# EAGLE design PJ20 (EAGLE 7.4.0)
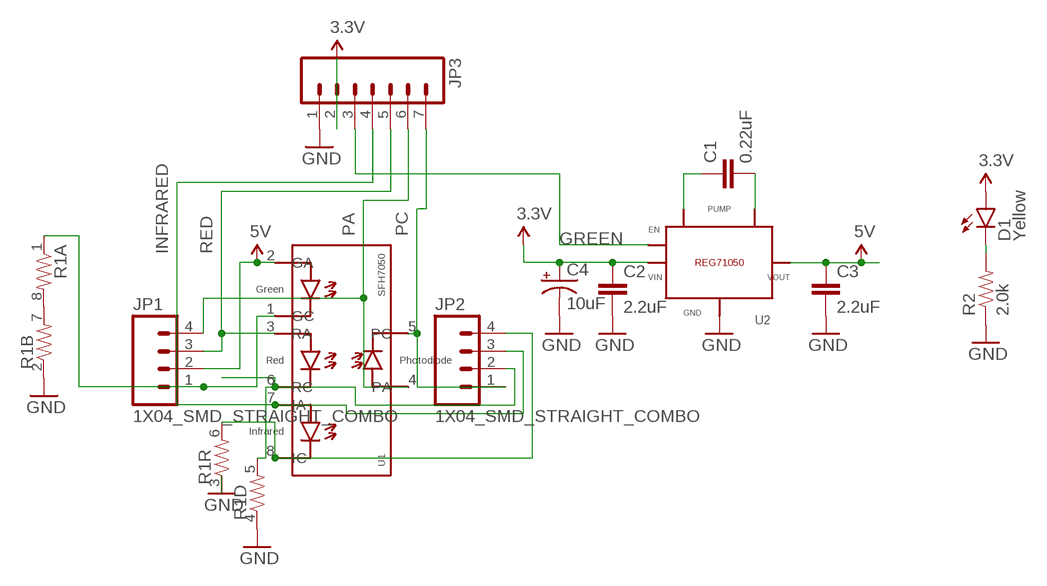
[diagram p0: schematic, sheet 1]

## Parts
C1  0.22uF  0.22UF-25V-10%(0603)  [0603-CAP]
C2  2.2uF  2.2UF-25V-+80/-20(0805)  [0805-CAP]
C3  2.2uF  2.2UF-25V-+80/-20(0805)  [0805-CAP]
C4  10uF  10UF-16V-10%(TANT)  [EIA3216]
D1  Yellow  LED-YELLOW0603  [LED-0603]
JP1  1X04_SMD_STRAIGHT_COMBO  M04SMD_STRAIGHT_COMBO  [1X04_SMD_STRAIGHT_COMBO]
JP2  1X04_SMD_STRAIGHT_COMBO  M04SMD_STRAIGHT_COMBO  [1X04_SMD_STRAIGHT_COMBO]
JP3  M07LOCK  [1X07_LOCK]
R1  RESISTOR-ARRAY0603-ARV  [0603-ARV]
R2  2.0k  2.0KOHM1/10W5%(0603)  [0603-RES]
U1  SFH7050  [SFH7050]
U2  REG71050  [DDC]

## Nets
3.3V: C2.1 C4.A(+) D1.A JP3.2 U2.5(VIN)
5V: C3.1 JP1.2 U1.2(GA) U2.1(VOUT)
GND: C2.2 C3.2 C4.C(-) JP3.1 R1.2 R1.3 R1.4 R2.1 U2.2(GND)
GREEN: JP3.3 U2.3(ENABLE)
INFRARED: JP2.3 JP3.4 U1.7(IA)
N$1: JP1.1 R1.1 U1.1(GC)
N$2: D1.C R2.2
N$3: C1.1 U2.4(CPUMP-)
N$4: C1.2 U2.6(CPUMP+)
N$8: JP2.2 R1.5 U1.6(RC)
N$10: JP2.4 R1.6 U1.8(IC)
N$11: R1.7 R1.8
PA: JP1.4 JP3.6 U1.4(PA)
PC: JP2.1 JP3.7 U1.5(PC)
RED: JP1.3 JP3.5 U1.3(RA)

## Library data of the parts
C1 = SparkFun-Capacitors:0.22UF-25V-10%(0603): CAP-07822; PROD_ID: CAP-07822
C2 C3 = SparkFun-Capacitors:2.2UF-25V-+80/-20(0805): CAP-11624; PROD_ID: CAP-11624
C4 = SparkFun-Capacitors:10UF-16V-10%(TANT): CAP-00811 1206/EIA-3216 Tantalum capacitor; PROD_ID: CAP-00811
D1 = SparkFun-LED:LED-YELLOW: Yellow SMD LEDs LilyPad 1206- DIO-09909 0603- DIO-09003 "SMART" means more efficient and expensive; PROD_ID: DIO-09003
JP1 JP2 = SparkFun-Connectors:M04: Header 4 Standard 4-pin 0.1" header. Use with straight break away headers (SKU : PRT-00116), right angle break away headers (PRT-00553), swiss pins (PRT-00743), machine pins (PRT-00117), and female headers (PRT-00115). Molex polarized connector foot print use with SKU : PRT-08231 with associated crimp pins and housings. 1MM SMD Version SKU: PRT-10208; PROD_ID: CONN-08511
JP3 = SparkFun-Connectors:M07: Header 7 Standard 7-pin 0.1" header. Use with straight break away headers (SKU : PRT-00116), right angle break away headers (PRT-00553), swiss pins (PRT-00743), machine pins (PRT-00117), and female headers (PRT-00115). NOTES ON THE VARIANTS LOCK and LOCK_LONGPADS... This footprint was designed to help hold the alignment of a through-hole component (i.e. 7-pin header) while soldering it into place. You may notice that each hole has been shifted either up or down by 0.005 of an inch from it's more standard position (which is usually a perfectly straight line). This slight alteration caused the pins (the squares in the middle) to touch the edges of the holes. Because they are alternating, it causes a "brace" to hold the header in place. 0.005 has proven to be the perfect amount of "off-center" position when using our standard breakaway headers. Although looks a little odd when you look at the bare footprint, once you have a header in there, the alteration is very hard to notice. Also, if you push a header all the way into place, it is covered up entirely on the bottom side. This idea of altering the position of holes to aid alignment will be further integrated into the Sparkfun Library for other footprints. It can help hold any component with 3 or more connection pins.
R1 = SparkFun-Resistors:RESISTOR-ARRAY: Array Chip Resistor Source: RS Component / Phycomp
R2 = SparkFun-Resistors:2.0KOHM1/10W5%(0603): RES-08296; PROD_ID: RES-08296
U1 = PJ20:SFH7050
U2 = PJ20:REG71050

## Board
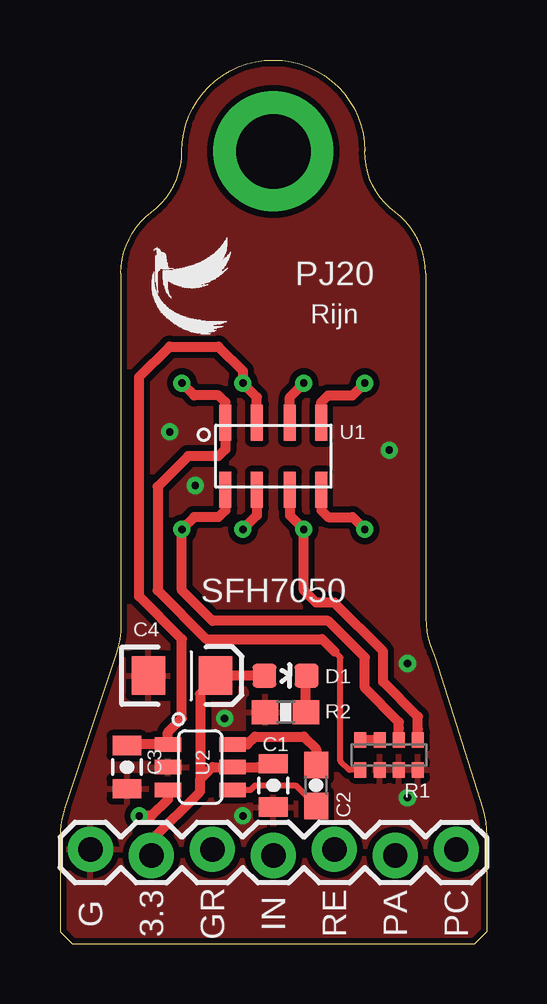
[diagram p1: board, top side]
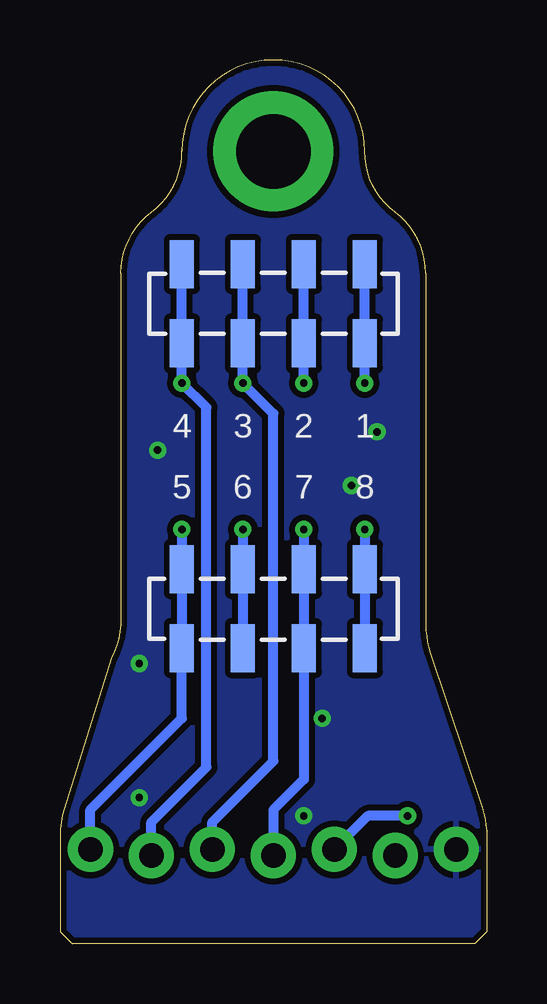
[diagram p2: board, bottom side, seen from below]

Size 17.78 x 36.83 mm. Coordinates in mm from the lower left corner, seen from the top.
Outline: 0.51,0 17.27,0 17.78,0.51 17.78,4.5 arc17 17.61,5.64 15.64,11.9 arc-27 15.24,13.6 15.24,27.94 arc53 13.97,30.48 arc-53 12.7,33.02 arc180 5.08,33.02 arc-53 3.81,30.48 arc53 2.54,27.94 2.54,13.32 arc-18 2.34,12.11 0.2,5.67 arc18 0,4.46 0,0.51 0.51,0
Copper layers (1*16): Top 0.035mm / dielectric 1.5mm / Bottom 0.035mm
Design rules "default *": minimum track width 8mil, minimum drill 12mil, track to track 6mil, track to pad 6mil, pad to pad 6mil, via to via 6mil, smd to smd 6mil, copper to edge 5mil, drill to drill 8mil, minimum pad ring 10mil, minimum via ring 8mil, stop-mask expansion 4mil, vias tented up to drill 24mil, thermal gap 10mil

### Footprints (pad centres in the part's own frame; a part is rotated, then mirrored left to right if it is on the bottom)
0603-CAP = smd 1.1 x 1: 1 -0.85,0; 2 0.85,0
0805-CAP = smd 0.8 x 1.2: 1 -0.9,0; 2 0.9,0
EIA3216 = smd 1.4 x 1.6: A 1.4,0; C -1.4,0
LED-0603 = smd 1 x 1: A 0,-0.877; C 0,0.877
1X04_SMD_STRAIGHT_COMBO = smd 1 x 2: 1 0,-1.65; 1-2 0,1.65; 2 2.54,1.65; 2-2 2.54,-1.65; 3 5.08,-1.65; 3-2 5.08,1.65; 4 7.62,1.65; 4-2 7.62,-1.65
1X07_LOCK = drill 1.016 pad 1.88: 1 0,0.127; 2 2.54,-0.127; 3 5.08,0.127; 4 7.62,-0.127; 5 10.16,0.127; 6 12.7,-0.127; 7 15.24,0.127
0603-ARV = smd 0.5 x 0.65: 1 -1.2,-0.625; 2 -0.4,-0.625; 3 0.4,-0.625; 4 1.2,-0.625; 5 1.2,0.625; 6 0.4,0.625; 7 -0.4,0.625; 8 -1.2,0.625
0603-RES = smd 1.1 x 1: 1 -0.85,0; 2 0.85,0
SFH7050 = smd 0.5 x 1.5: 1 -2,1.4; 2 -0.69,1.4; 3 0.69,1.4; 4 2,1.4; 5 2,-1.4; 6 0.69,-1.4; 7 -0.69,-1.4; 8 -2,-1.4
DDC = smd 0.6 x 1.1: 1 -0.95,-1.35; 2 0,-1.35; 3 0.95,-1.35; 4 0.95,1.35; 5 0,1.35; 6 -0.95,1.35

### Placement (x,y rotation side)
C1  10.67,6.6 90 top
C2  8.89,6.6 270 top
C3  2.79,7.37 270 top
C4  5.08,11.18 0 top
D1  9.4,11.18 270 top
JP1  5.08,26.67 180 bottom
JP2  12.7,13.97 0 bottom
JP3  1.27,3.81 0 top
R1  13.72,7.87 0 top
R2  9.4,9.65 0 top
U1  8.89,20.32 0 top
U2  5.84,7.37 270 top
U$1  [LOGO]  3.81,25.4 0 top

### Tracks (layer width: path | path; a pad name or v marks a point on that pad's centre or on a via)
3.3V
  Top 0.406: C2.1 8.24,7.37 U2.5 6.35,7.37 5.84,6.86 | JP3.2 3.81,4.32 5.84,6.35 5.84,6.86 | D1.A C4.A 6.48,11.05 5.84,10.41 5.84,6.86
5V  (via drill 0.3)
  Top 0.406: U1.2 8.2,22.79 v7.62,23.37 7.62,23.88 6.6,24.89 4.57,24.89 3.3,23.62 3.3,14.48 5.08,12.7 5.08,9.4 4.49,8.81 U2.1 2.84,8.32 C3.1
  Bottom 0.406: v7.62,23.37 JP1.2
GND  (via drill 0.3)
  other vias: 14.48,11.68 14.48,6.1 6.86,9.4 7.62,5.33 4.57,21.34 13.72,20.57 5.64,19.1
  pour Top (isolate 0.254, rank 6): 2.54,29.21 5.08,33.02 5.08,35.56 7.62,36.83 10.16,36.83 12.7,35.56 12.7,33.02 15.24,29.21 15.24,12.7 17.78,5.08 17.78,0 0,0 0,5.08 2.54,12.7
  pour Bottom (isolate 0.254, rank 6): 2.54,29.21 3.81,33.02 5.08,35.56 7.62,36.83 10.16,36.83 12.7,35.56 12.7,33.02 15.24,29.21 15.24,12.7 17.78,5.08 17.78,0 0,0 0,5.08 2.54,12.7
GREEN  (via drill 0.3)
  Top 0.406: U2.3 4.49,6.02 3.81,5.33 v3.3,5.33
  Bottom 0.406: v3.3,5.33 4.95,5.33 JP3.3
INFRARED  (via drill 0.3)
  Top 0.406: U1.7 8.2,17.85 v7.62,17.27
  Bottom 0.406: v7.62,17.27 JP2.3 7.62,6.86 8.89,5.59 JP3.4
N$1  (via drill 0.3)
  Top 0.254: R1.1 12.05,7.25 11.68,7.62 11.68,11.94 11.43,12.19
  Top 0.406: v5.08,23.37 5.59,22.86 6.6,22.86 6.89,22.57 U1.1 6.89,20.61 6.6,20.32 5.33,20.32 4.06,19.05 4.06,14.73 6.1,12.7 10.92,12.7 11.43,12.19
  Bottom 0.406: v5.08,23.37 JP1.1
N$2
  Top 0.406: R2.2 10.25,11.15 D1.C
N$3
  Top 0.254: U2.4 7.94,6.42 8.13,6.6 9.82,6.6 C1.1
N$4
  Top 0.406: U2.6 7.81,8.32 8.13,8.64 10.16,8.64 10.67,8.13 C1.2
N$5  (via drill 3.1 pad 5)
  other vias: 8.89,33.02
N$8  (via drill 0.3)
  Top 0.406: U1.6 9.58,17.85 v10.16,17.27 10.16,14.73 10.67,14.22 11.43,14.22 13.46,12.19 13.46,10.92 14.91,9.47 14.92,8.96 R1.5
  Bottom 0.406: v10.16,17.27 JP2.2
N$10  (via drill 0.3)
  Top 0.406: U1.8 6.89,18.07 6.6,17.78 5.59,17.78 v5.08,17.27 5.08,14.73 6.35,13.46 11.18,13.46 12.7,11.94 12.7,10.67 14.12,9.25 14.12,9 R1.6
  Bottom 0.406: v5.08,17.27 JP2.4
N$11
  Top 0.406: R1.8 R1.7
PA  (via drill 0.3)
  Top 0.406: U1.4 10.89,22.57 11.18,22.86 12.19,22.86 v12.7,23.37
  Bottom 0.406: JP1.4 v12.7,23.37 11.68,22.35 11.68,7.37 13.97,5.08 JP3.6
PC  (via drill 0.3)
  Top 0.406: U1.5 10.89,18.07 11.18,17.78 12.19,17.78 v12.7,17.27
  Bottom 0.406: v12.7,17.27 JP2.1 12.7,9.4 16.51,5.59 JP3.7
RED  (via drill 0.3)
  Top 0.406: U1.3 9.58,22.79 v10.16,23.37
  Bottom 0.406: JP1.3 v10.16,23.37 8.89,22.1 8.89,7.62 11.43,5.08 JP3.5

### Text on the board
tNames: PJ20 | Rijn | SFH7050 | G | 3.3 | GR | IN | RE | PA | PC
bNames: 1 | 2 | 3 | 4 | 8 | 7 | 6 | 5